# Altium schematic sheet FP_Connectors.SchDoc: =DocumentName
size A4; DocumentNumber: 1; Revision: 0; SheetNumber: 5; SheetTotal: 10; Last modified by: Krzysztof Belewicz
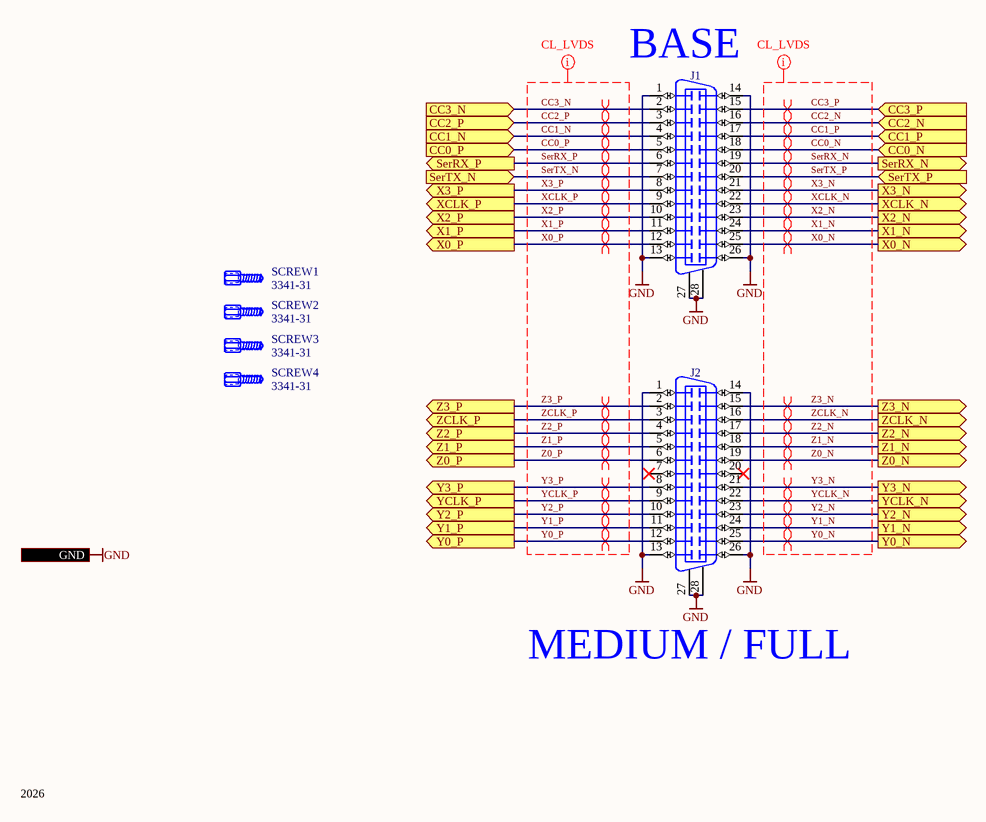
[diagram p0: FP_Connectors.SchDoc]

## Parts
J1  N10226-5212PC  [3M_N10226-5212PC]  (value not drawn)
J2  N10226-5212PC  [3M_N10226-5212PC]  (value not drawn)
SCREW1  3341-31  [3M_3341-31]
SCREW2  3341-31  [3M_3341-31]
SCREW3  3341-31  [3M_3341-31]
SCREW4  3341-31  [3M_3341-31]

## Ports
CC0_N (in), CC0_P (in), CC1_N (in), CC1_P (in), CC2_N (in), CC2_P (in), CC3_N (in), CC3_P (in), GND, SerRX_N (out), SerRX_P (out), SerTX_N (in), SerTX_P (in), X0_N (out), X0_P (out), X1_N (out), X1_P (out), X2_N (out), X2_P (out), X3_N (out), X3_P (out), XCLK_N (out), XCLK_P (out), Y0_N (out), Y0_P (out), Y1_N (out), Y1_P (out), Y2_N (out), Y2_P (out), Y3_N (out), Y3_P (out), YCLK_N (out), YCLK_P (out), Z0_N (out), Z0_P (out), Z1_N (out), Z1_P (out), Z2_N (out), Z2_P (out), Z3_N (out), Z3_P (out), ZCLK_N (out), ZCLK_P (out)

## Nets
GND: J1.1 J1.13 J1.14 J1.26 J1.27 J1.28 J2.1 J2.13 J2.14 J2.26 J2.27 J2.28 ; port GND
CC0_N: J1.18 ; port CC0_N
CC0_P: J1.5 ; port CC0_P
CC1_N: J1.4 ; port CC1_N
CC1_P: J1.17 ; port CC1_P
CC2_N: J1.16 ; port CC2_N
CC2_P: J1.3 ; port CC2_P
CC3_N: J1.2 ; port CC3_N
CC3_P: J1.15 ; port CC3_P
SerRX_N: J1.19 ; port SerRX_N
SerRX_P: J1.6 ; port SerRX_P
SerTX_N: J1.7 ; port SerTX_N
SerTX_P: J1.20 ; port SerTX_P
X0_N: J1.25 ; port X0_N
X0_P: J1.12 ; port X0_P
X1_N: J1.24 ; port X1_N
X1_P: J1.11 ; port X1_P
X2_N: J1.23 ; port X2_N
X2_P: J1.10 ; port X2_P
X3_N: J1.21 ; port X3_N
X3_P: J1.8 ; port X3_P
XCLK_N: J1.22 ; port XCLK_N
XCLK_P: J1.9 ; port XCLK_P
Y0_N: J2.25 ; port Y0_N
Y0_P: J2.12 ; port Y0_P
Y1_N: J2.24 ; port Y1_N
Y1_P: J2.11 ; port Y1_P
Y2_N: J2.23 ; port Y2_N
Y2_P: J2.10 ; port Y2_P
Y3_N: J2.21 ; port Y3_N
Y3_P: J2.8 ; port Y3_P
YCLK_N: J2.22 ; port YCLK_N
YCLK_P: J2.9 ; port YCLK_P
Z0_N: J2.19 ; port Z0_N
Z0_P: J2.6 ; port Z0_P
Z1_N: J2.18 ; port Z1_N
Z1_P: J2.5 ; port Z1_P
Z2_N: J2.17 ; port Z2_N
Z2_P: J2.4 ; port Z2_P
Z3_N: J2.15 ; port Z3_N
Z3_P: J2.2 ; port Z3_P
ZCLK_N: J2.16 ; port ZCLK_N
ZCLK_P: J2.3 ; port ZCLK_P

Not connected (* = marked no-connect by the designer): J2 7* 20*

## Layout directives
differential pair: CC0_N, CC0_P, CC1_N, CC1_P, CC2_N, CC2_P, CC3_N, CC3_P, SerRX_N, SerRX_P, SerTX_N, SerTX_P, X0_N, X0_P, X1_N, X1_P, X2_N, X2_P, X3_N, X3_P, XCLK_N, XCLK_P, Y0_N, Y0_P, Y1_N, Y1_P, Y2_N, Y2_P, Y3_N, Y3_P, YCLK_N, YCLK_P, Z0_N, Z0_P, Z1_N, Z1_P, Z2_N, Z2_P, Z3_N, Z3_P, ZCLK_N, ZCLK_P
net class CL_LVDS: CC0_N, CC0_P, CC1_N, CC1_P, CC2_N, CC2_P, CC3_N, CC3_P, SerRX_N, SerRX_P, SerTX_N, SerTX_P, X0_N, X0_P, X1_N, X1_P, X2_N, X2_P, X3_N, X3_P, XCLK_N, XCLK_P, Y0_N, Y0_P, Y1_N, Y1_P, Y2_N, Y2_P, Y3_N, Y3_P, YCLK_N, YCLK_P, Z0_N, Z0_P, Z1_N, Z1_P, Z2_N, Z2_P, Z3_N, Z3_P, ZCLK_N, ZCLK_P

## Notes on the sheet
- (near J1) BASE
- (near J2) MEDIUM / FULL
- 2026
- SINARA
- Project:
- Designed by:
- Filename:
- Size:
- Version:
- Last mod. date :
- Sheet:
- A4
- Copyright _______________
  This source describes Open Hardware and is licensed under the CERN-OHL-W v2. You may redistribute and modify this documentation and make products using it under the terms of the CERN-OHL-W v2 (https:/cern.ch/cern-ohl). This documentation is distributed WITHOUT ANY EXPRESS OR IMPLIED WARRANTY, INCLUDING OF MERCHANTABILITY, SATISFACTORY QUALITY AND FITNESS FOR A PARTICULAR PURPOSE. Please see the CERN-OHL-W v2 for applicable conditions.
  As per CERN-OHL-W v2 section 4.1, should You produce hardware based on these sources, You must maintain the Source Location visible on the external case of the product you make using this documentation.
  Source location: =Github
- Last mod. by :

## Library data of the parts
J1 J2 = 3M_N10226-5212PC: Connector Mini D Ribbon (MDR) 26 Female; Part Description: 26 contacts, Mini D Ribbon (MDR), .050" Boardmount Through-hole Right Angle Receptacle-Shielded, Diecast Body, 102 Series; Manufacturer: 3M; PressFit: No; Part Number: N10226-5212PC; Component Kind: Standard; Component Type: Standard; Footprint: MDR 26; Pin Count: 28; Family: MDR 26; Mounted: Yes; Socket: No; SMD: No; Sense: No; Status: None; Manufacturer Part Number: N10226-5212PC; ComponentHeight: 9.4mm; HelpURL: \\cern.ch\dfs\Applications\Altium\Datasheets\3M_N10226-5212PC.pdf; Author: CERN DEM JLC; CreateDate: 18.11.2008; LatestRevisionDate: 14.10.2009
SCREW1-SCREW4 = MECH_MDR_screw_lock: VHDCI Female Screw Lock; Part Description: MDR Female Screw Locks, Thread Size: M2.5; Manufacturer: 3M; PressFit: No; Part Number: 3341-31; Component Kind: Standard; Component Type: Mechanical; Pin Count: 0; PackageDescription: MDR Female Screw Locks, Thread Size: M2.5; Mounted: Yes; Socket: No; SMD: No; Sense: No; Status: None; Value: 3341-31; Manufacturer Part Number: 3341-31; ComponentHeight: 5.48mm; HelpURL: \\cern.ch\dfs\Applications\Altium\Datasheets\TYCO_749087-2.pdf; Author: GK; CreateDate: 10.09.2013; LatestRevisionDate: 10.09.2013